# Altium schematic sheet SPARC_schematic.SchDoc
size A4; SheetNumber: 1; SheetTotal: 1
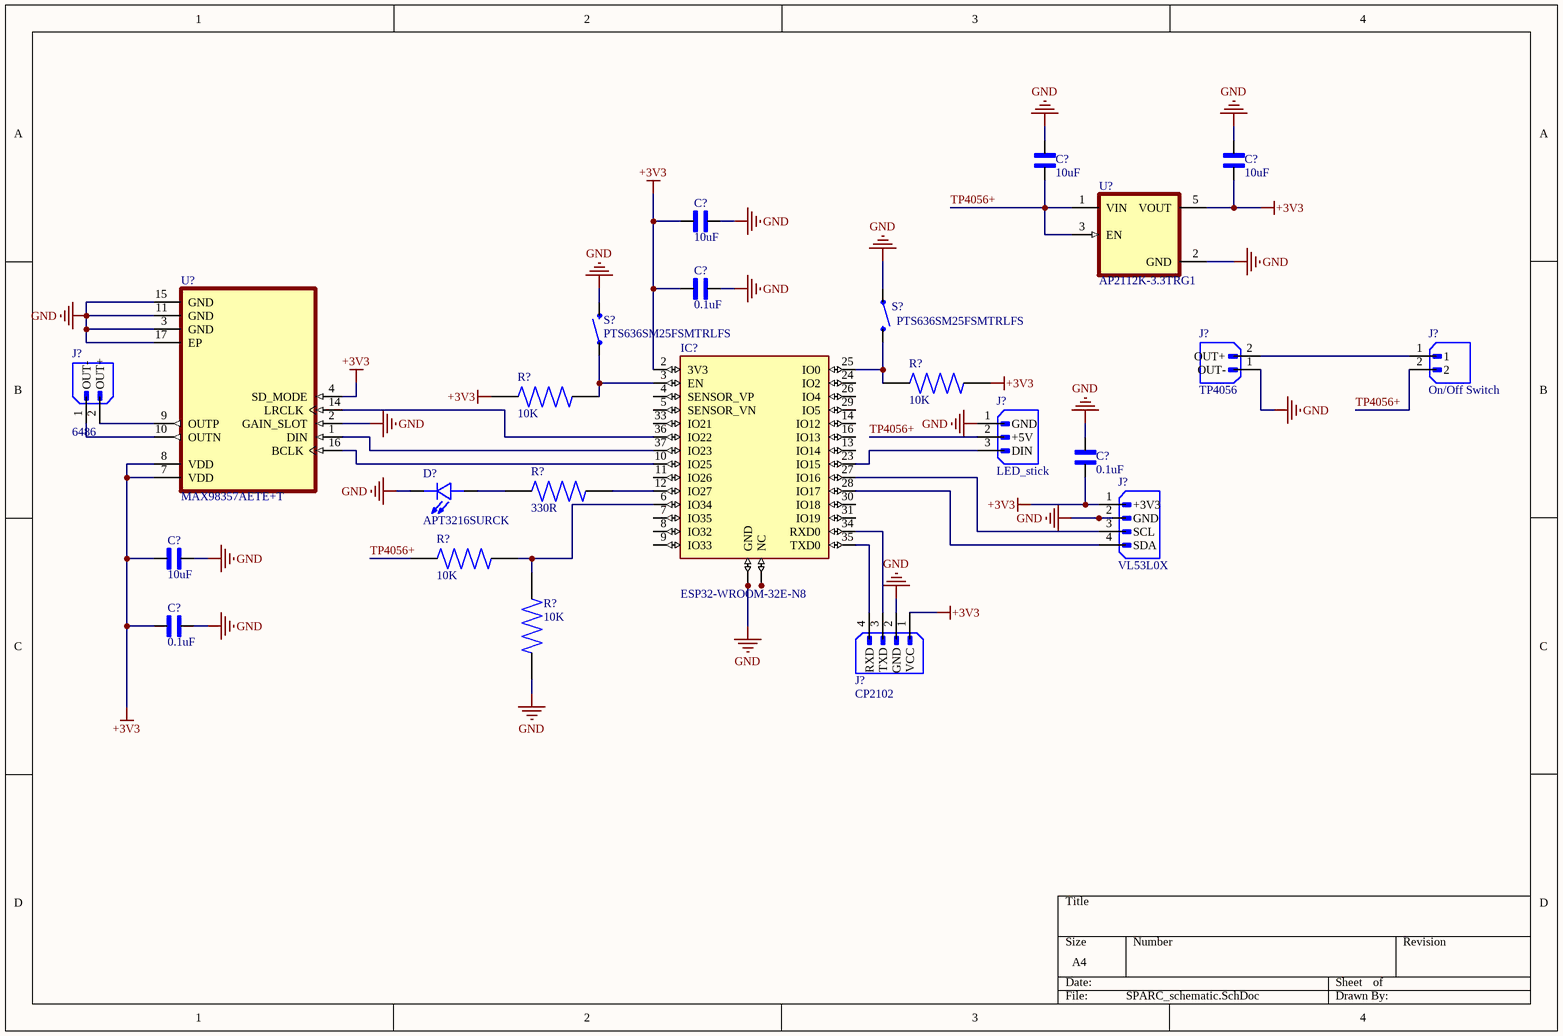
[diagram p0: SPARC_schematic.SchDoc]

## Parts
(Parts that share a designator on the sheet are numbered #1, #2 ... from top to bottom, then left to right.)
C?#1  10uF  [CAPC3216X110N]
C?#2  10uF  [CAPC3216X110N]
C?#3  10uF  [CAPC3216X110N]
C?#4  0.1uF  [CAPC3216X110N]
C?#5  0.1uF  [CAPC3216X110N]
C?#6  10uF  [CAPC3216X110N]
C?#7  0.1uF  [CAPC3216X110N]
D?  APT3216SURCK  [LED_APT3216SURCK]
IC?  ESP32-WROOM-32E-N8  [ESP32WROOM32EN8]
J?#1  TP4056  [JST_B2B-XH-A]
J?#2  On/Off Switch  [JST_B2B-XH-A]
J?#3  6486  [JST_B2B-XH-A]
J?#4  LED_stick  [JST_B3B-XH-A]
J?#5  VL53L0X  [JST_B4B-XH-A]
J?#6  CP2102  [JST_B4B-XH-A]
R?#1  10K  [RES_ERJP08D8251V]
R?#2  10K  [RES_ERJP08D8251V]
R?#3  330R  [RES_ERJP08D8251V]
R?#4  10K  [RES_ERJP08D8251V]
R?#5  10K  [RES_ERJP08D8251V]
S?#1  PTS636SM25FSMTRLFS  [TACTILE_SWITCH_SMD_6.0X3.5MM]
S?#2  PTS636SM25FSMTRLFS  [TACTILE_SWITCH_SMD_6.0X3.5MM]
U?#1  AP2112K-3.3TRG1  [SOT95P285X140-5N]
U?#2  MAX98357AETE+T  [QFN50P300X300X80-17N]

## Nets
+3V3: C?#2.2 C?#3.2 C?#4.2 C?#5.2 C?#6.2 C?#7.2 IC?.2(3V3) J?#5.1(+3V3) J?#6.1(VCC) R?#1.2 R?#2.2 U?#1.5(VOUT) U?#2.4(SD_MODE) U?#2.7(VDD) U?#2.8(VDD)
GND: C?#1.1 C?#2.1 C?#3.1 C?#4.1 C?#5.1 C?#6.1 C?#7.1 D?.1(C) IC?.1(GND) IC?.15(GND) IC?.38(GND) IC?.39(GND) IC?.40(GND) IC?.41(GND) IC?.42(GND) IC?.43(GND) IC?.44(GND) IC?.45(GND) IC?.46(GND) IC?.47(GND) J?#1.1(OUT-) J?#4.1(GND) J?#5.2(GND) J?#6.2(GND) R?#5.2 S?#1.1 S?#2.2 U?#1.2(GND) U?#2.2(GAIN_SLOT) U?#2.3(GND) U?#2.11(GND) U?#2.15(GND) U?#2.17(EP)
TP4056+: C?#1.2 J?#2.2 J?#4.2(+5V) R?#4.2 U?#1.1(VIN) U?#1.3(EN)
NetD?_2: D?.2(A) R?#3.1
NetIC?_3: IC?.3(EN) R?#2.1 S?#2.1
NetIC?_6: IC?.6(IO34) R?#4.1 R?#5.1
NetIC?_10: IC?.10(IO25) U?#2.16(BCLK)
NetIC?_12: IC?.12(IO27) R?#3.2
NetIC?_17: IC?.17(NC) IC?.18(NC) IC?.19(NC) IC?.20(NC) IC?.21(NC) IC?.22(NC) IC?.32(NC)
NetIC?_23: IC?.23(IO15) J?#4.3(DIN)
NetIC?_25: IC?.25(IO0) R?#1.1 S?#1.2
NetIC?_27: IC?.27(IO16) J?#5.3(SCL)
NetIC?_28: IC?.28(IO17) J?#5.4(SDA)
NetIC?_34: IC?.34(RXD0) J?#6.3(TXD)
NetIC?_35: IC?.35(TXD0) J?#6.4(RXD)
NetIC?_36: IC?.36(IO22) U?#2.14(LRCLK)
NetIC?_37: IC?.37(IO23) U?#2.1(DIN)
NetJ?#1_2: J?#1.2(OUT+) J?#2.1
NetJ?#3_1: J?#3.1(OUT-) U?#2.10(OUTN)
NetJ?#3_2: J?#3.2(OUT+) U?#2.9(OUTP)

Not connected (* = marked no-connect by the designer): IC? 4(SENSOR_VP) 5(SENSOR_VN) 7(IO35) 8(IO32) 9(IO33) 11(IO26) 13(IO14) 14(IO12) 16(IO13) 24(IO2) 26(IO4) 29(IO5) 30(IO18) 31(IO19) 33(IO21)

## Library data of the parts
C?#1-C?#3 C?#6 = C - 10uF: 1206 C 1uF Ceramic Multilayer Capacitor, 50 VDC, +125degC, X7R Dielec, +/-10% | KEMET C1206F105K5RACTU; SnapEDA_Link: https://www.snapeda.com/parts/C1206F105K5RACTU/Kemet/view-part/?ref=snap; Package: 1206 KEMET; Value: *; MF: KEMET; MP: C1206F105K5RACTU; Check_prices: https://www.snapeda.com/parts/C1206F105K5RACTU/Kemet/view-part/?ref=eda
C?#4 C?#5 C?#7 = C - 0.1uF: 1206 C 1uF Ceramic Multilayer Capacitor, 50 VDC, +125degC, X7R Dielec, +/-10% | KEMET C1206F105K5RACTU; SnapEDA_Link: https://www.snapeda.com/parts/C1206F105K5RACTU/Kemet/view-part/?ref=snap; Package: 1206 KEMET; Value: *; MF: KEMET; MP: C1206F105K5RACTU; Check_prices: https://www.snapeda.com/parts/C1206F105K5RACTU/Kemet/view-part/?ref=eda
D? = APT3216SURCK: Red 630nm LED Indication - Discrete 1.95V 1206 (3216 Metric); MF: Kingbright; SnapEDA_Link: https://www.snapeda.com/parts/APT3216SURCK/Kingbright/view-part/?ref=snap; Package: 1206 Kingbright; Value: *; MP: APT3216SURCK; Check_prices: https://www.snapeda.com/parts/APT3216SURCK/Kingbright/view-part/?ref=eda
IC? = ESP32-WROOM-32E-N8: WLAN+BT Module 2412MHz to 2484MHz 47-Pin SMD Module; Manufacturer Part Number: ESP32-WROOM-32E-N4; MF: Espressif Systems; Max Supply Voltage: 3.6V; Min Supply Voltage: 3V; Nominal Supply Voltage (DC): 3.3V; SnapEDA_Link: https://www.snapeda.com/parts/ESP32-WROOM-32E-N8/Espressif+Systems/view-part/?ref=snap; Package: SMD-44 Espressif Systems; Value: *; MP: ESP32-WROOM-32E-N8; Check_prices: https://www.snapeda.com/parts/ESP32-WROOM-32E-N8/Espressif+Systems/view-part/?ref=eda; Supplier: DigiKey; Supplier Part Number: 1965-ESP32-WROOM-32E-N4DKR-ND; Manufacturer: Espressif Systems; RoHS: Compliant; Category: RF Receivers, Transceivers; Stock: 5249; Pricing: 1=4.99, 10=4.314, 25=4.08, 100=3.7585, 250=3.56568 (USD); Height - Seated (Max): 3.25mm; Length: 25.5mm; Max Operating Temperature: 85°C; Min Operating Temperature: -40°C; Number of Terminals: 38; REACH SVHC: Unaffected; Terminal Pitch: 1.27mm; Width: 18mm; ComponentLink1URL: https://datasheet.octopart.com:443/ESP32-WROOM-32E-N4-Espressif-Systems-datasheet-182247776.pdf?src-supplier=IHS; ComponentLink1Description: https://datasheet.octopart.com:443/ESP32-WROOM-32E-N4-Espressif-Systems-datasheet-182247776.pdf?src-supplier=IHS; ComponentLink2URL: https://datasheet.octopart.com:443/ESP32-WROOM-32E-N4-Espressif-Systems-datasheet-192340067.pdf?src-supplier=LCSC; ComponentLink2Description: https://datasheet.octopart.com:443/ESP32-WROOM-32E-N4-Espressif-Systems-datasheet-192340067.pdf?src-supplier=LCSC; ComponentLink3URL: https://datasheet.octopart.com:443/ESP32-WROOM-32E-N4-Espressif-Systems-datasheet-188867343.pdf?src-supplier=TME; ComponentLink3Description: https://datasheet.octopart.com:443/ESP32-WROOM-32E-N4-Espressif-Systems-datasheet-188867343.pdf?src-supplier=TME; ComponentLink4URL: https://datasheet.octopart.com:443/ESP32-WROOM-32E-N4-Espressif-Systems-datasheet-165560559.pdf?src-supplier=TME; ComponentLink4Description: https://datasheet.octopart.com:443/ESP32-WROOM-32E-N4-Espressif-Systems-datasheet-165560559.pdf?src-supplier=TME; ComponentLink5URL: https://datasheet.octopart.com:443/ESP32-WROOM-32E-N4-Espressif-Systems-datasheet-151884363.pdf?src-supplier=Future+Electronics; ComponentLink5Description: https://datasheet.octopart.com:443/ESP32-WROOM-32E-N4-Espressif-Systems-datasheet-151884363.pdf?src-supplier=Future+Electronics
J?#1 = TP4056: MF: {'manufacturer': u'JST Sales America Inc.'}; MP: B2B-XH-A; Package: None; Price: None; Value: *; Availability: Unavailable
J?#2 = On/Off Switch: MF: {'manufacturer': u'JST Sales America Inc.'}; MP: B2B-XH-A; Package: None; Price: None; Value: *; Availability: Unavailable
J?#3 = 6486: MF: {'manufacturer': u'JST Sales America Inc.'}; MP: B2B-XH-A; Package: None; Price: None; Value: *; Availability: Unavailable
J?#4 = B3B-XH-A: Connector Header Through Hole 3 position 0.098 (2.50mm); MF: JST Sales; SnapEDA_Link: https://www.snapeda.com/parts/B3B-XH-A/JST/view-part/?ref=snap; Package: None; Value: *; MP: B3B-XH-A; Check_prices: https://www.snapeda.com/parts/B3B-XH-A/JST/view-part/?ref=eda
J?#5 = VL53L0X: Connector Header Through Hole 4 position 0.098 (2.50mm); MF: JST Sales; MP: B4B-XH-A; SnapEDA_Link: https://www.snapeda.com/parts/B4B-XH-A/JST/view-part/?ref=snap; Package: None; Value: *; Check_prices: https://www.snapeda.com/parts/B4B-XH-A/JST/view-part/?ref=eda
J?#6 = CP2102: Connector Header Through Hole 4 position 0.098 (2.50mm); MF: JST Sales; MP: B4B-XH-A; SnapEDA_Link: https://www.snapeda.com/parts/B4B-XH-A/JST/view-part/?ref=snap; Package: None; Value: *; Check_prices: https://www.snapeda.com/parts/B4B-XH-A/JST/view-part/?ref=eda
R?#1 R?#2 R?#4 R?#5 = R - 10K: MP: ERJP08D8251V; Package: None; Value: *; Price: None; Availability: Unavailable
R?#3 = R - 330: MP: ERJP08D8251V; Package: None; Value: *; Price: None; Availability: Unavailable
S?#1 S?#2 = PTS636SM25FSMTRLFS: Switch Tactile N.O. SPST Rectangular Button F-Lead 0.05A 12VDC 1.77N SMD T/R; MF: CK; SnapEDA_Link: https://www.snapeda.com/parts/PTS636SM25FSMTRLFS/C%2526K/view-part/?ref=snap; Package: None; Value: *; MP: PTS636SM25FSMTRLFS; Check_prices: https://www.snapeda.com/parts/PTS636SM25FSMTRLFS/C%2526K/view-part/?ref=eda
U?#1 = AP2112K-3.3TRG1: AP2112 Series 0.6 A 3.3 V Fixed Output SMT LDO Linear Regulator - SOT23-5; MF: Diodes Inc.; Accuracy: 1.5%; Dropout Voltage: 400mV; Max Supply Voltage: 6V; Max Junction Temperature (Tj): 85°C; Max Output current: 600mA; Max Output Voltage: 3.3495V; Min Input Voltage: 2.5V; Min Output Voltage: 3.2505V; Nominal Supply Current: 55µA; Number of Channels: 1; Output Voltage: 3.3V; Polarity: Positive; Value: *; Purchase-URL: https://pricing.snapeda.com/search/part/AP2112K-3.3TRG1/?ref=eda; Package: SOT-753 Diodes Inc.; Availability: In Stock; Check_prices: https://www.snapeda.com/parts/AP2112K-3.3TRG1/Diodes+Inc./view-part/?ref=eda; Price: None; SnapEDA_Link: https://www.snapeda.com/parts/AP2112K-3.3TRG1/Diodes+Inc./view-part/?ref=snap; MP: AP2112K-3.3TRG1; Supplier: DigiKey; Supplier Part Number: AP2112K-3.3TRG1DIDKR-ND; Manufacturer: Diodes Inc.; Manufacturer Part Number: AP2112K-3.3TRG1; RoHS: Compliant; Category: LDO Voltage Regulators; Stock: 445161; Pricing: 1=0.28, 10=0.191, 25=0.1692, 50=0.1558, 100=0.1447 (USD); Ambient Temperature Range High: 85°C; Case/Package: LSSOP; China RoHS: Compliant; Country of Origin: Mainland China; Export Control Classification Number (ECCN) Code: EAR99; Height: 1.4mm; Height - Seated (Max): 1.45mm; Harmonized Tariff Schedule (HTS) Code: 8542.39.00.60; Introduction Date: 2010-08-17; Lead Free: Lead Free; Length: 2.92mm; Lifecycle Status: Production; Max Operating Temperature: 85°C; Min Operating Temperature: -40°C; Min Supply Voltage: 2.5V; Mounting Technology: Surface Mount; Number of Circuits: 1; Number of Outputs: 1; Pins: 5; Number of Regulators: 1; Number of Terminals: 5; Output Current: 600mA; Output Type: Fixed; Packaging: Digi-Reel®; Quiescent Current: 55µA; REACH SVHC: Unaffected; Schedule B: 8542390000, 8542390000|8542390000|8542390000|8542390000|8542390000; Terminal Pitch: 950µm; Voltage Tolerance: 1.5%; Width: 1.6mm; ComponentLink1URL: https://datasheet.octopart.com:443/AP2112K-3.3TRG1-Diodes-Inc.-datasheet-101745658.pdf?src-supplier=IHS; ComponentLink1Description: https://datasheet.octopart.com:443/AP2112K-3.3TRG1-Diodes-Inc.-datasheet-101745658.pdf?src-supplier=IHS; ComponentLink2URL: https://datasheet.octopart.com:443/AP2112K-3.3TRG1-Diodes-Inc.-datasheet-182385097.pdf?src-supplier=IHS; ComponentLink2Description: https://datasheet.octopart.com:443/AP2112K-3.3TRG1-Diodes-Inc.-datasheet-182385097.pdf?src-supplier=IHS; ComponentLink3URL: https://datasheet.octopart.com:443/AP2112K-3.3TRG1-Diodes-Inc.-datasheet-37177583.pdf?src-supplier=SHENGYU+ELECTRONICS; ComponentLink3Description: https://datasheet.octopart.com:443/AP2112K-3.3TRG1-Diodes-Inc.-datasheet-37177583.pdf?src-supplier=SHENGYU+ELECTRONICS; ComponentLink4URL: https://sigma.octopart.com:443/138895853/technical_drawing/Diodes-Inc.-AP2112K-3.3TRG1.pdf?src-supplier=Upverter; ComponentLink4Description: https://sigma.octopart.com:443/138895853/technical_drawing/Diodes-Inc.-AP2112K-3.3TRG1.pdf?src-supplier=Upverter
U?#2 = MAX98357AETE+T: Tiny, Low-Cost, PCM Class D Amplifier with Class AB Performance; MF: Analog Devices; SnapEDA_Link: https://www.snapeda.com/parts/MAX98357AETE+T/Analog+Devices/view-part/?ref=snap; Package: TQFN-16 Maxim; Value: *; MP: MAX98357AETE+T; Check_prices: https://www.snapeda.com/parts/MAX98357AETE+T/Analog+Devices/view-part/?ref=eda